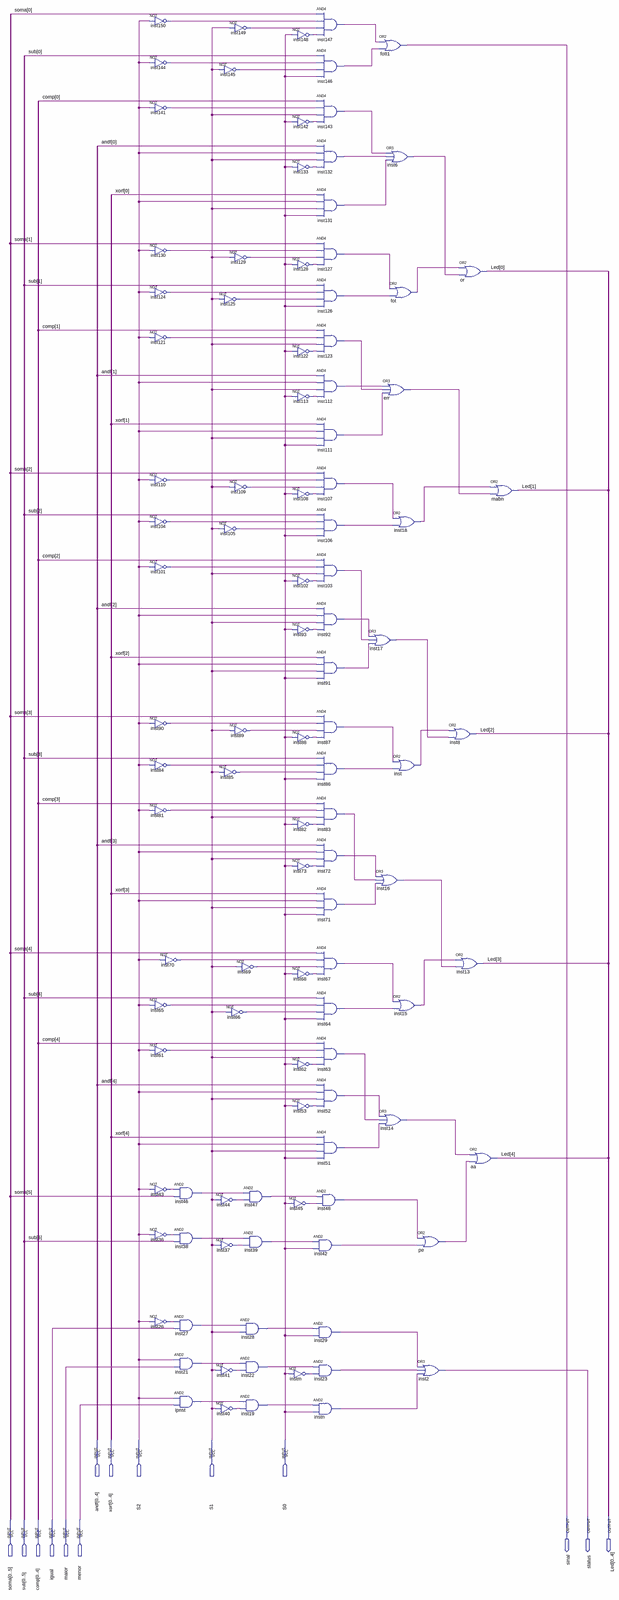
[diagram p0: schematic sheet, whole]
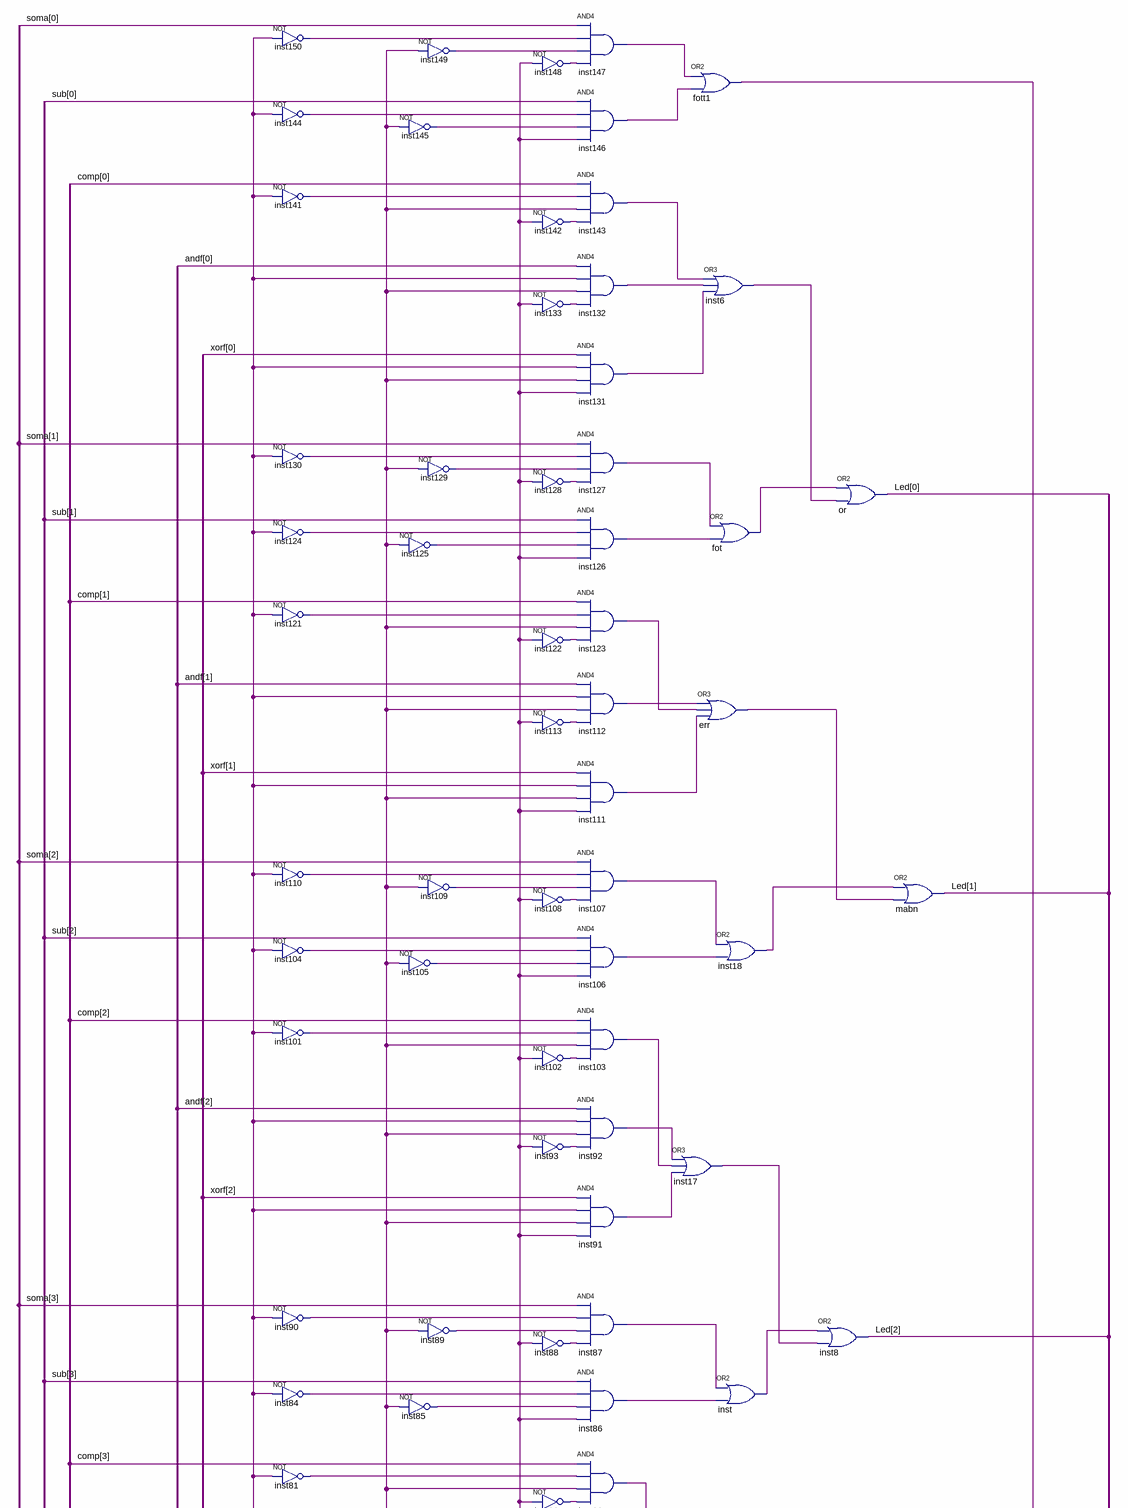
[diagram p1: schematic sheet, upper part]
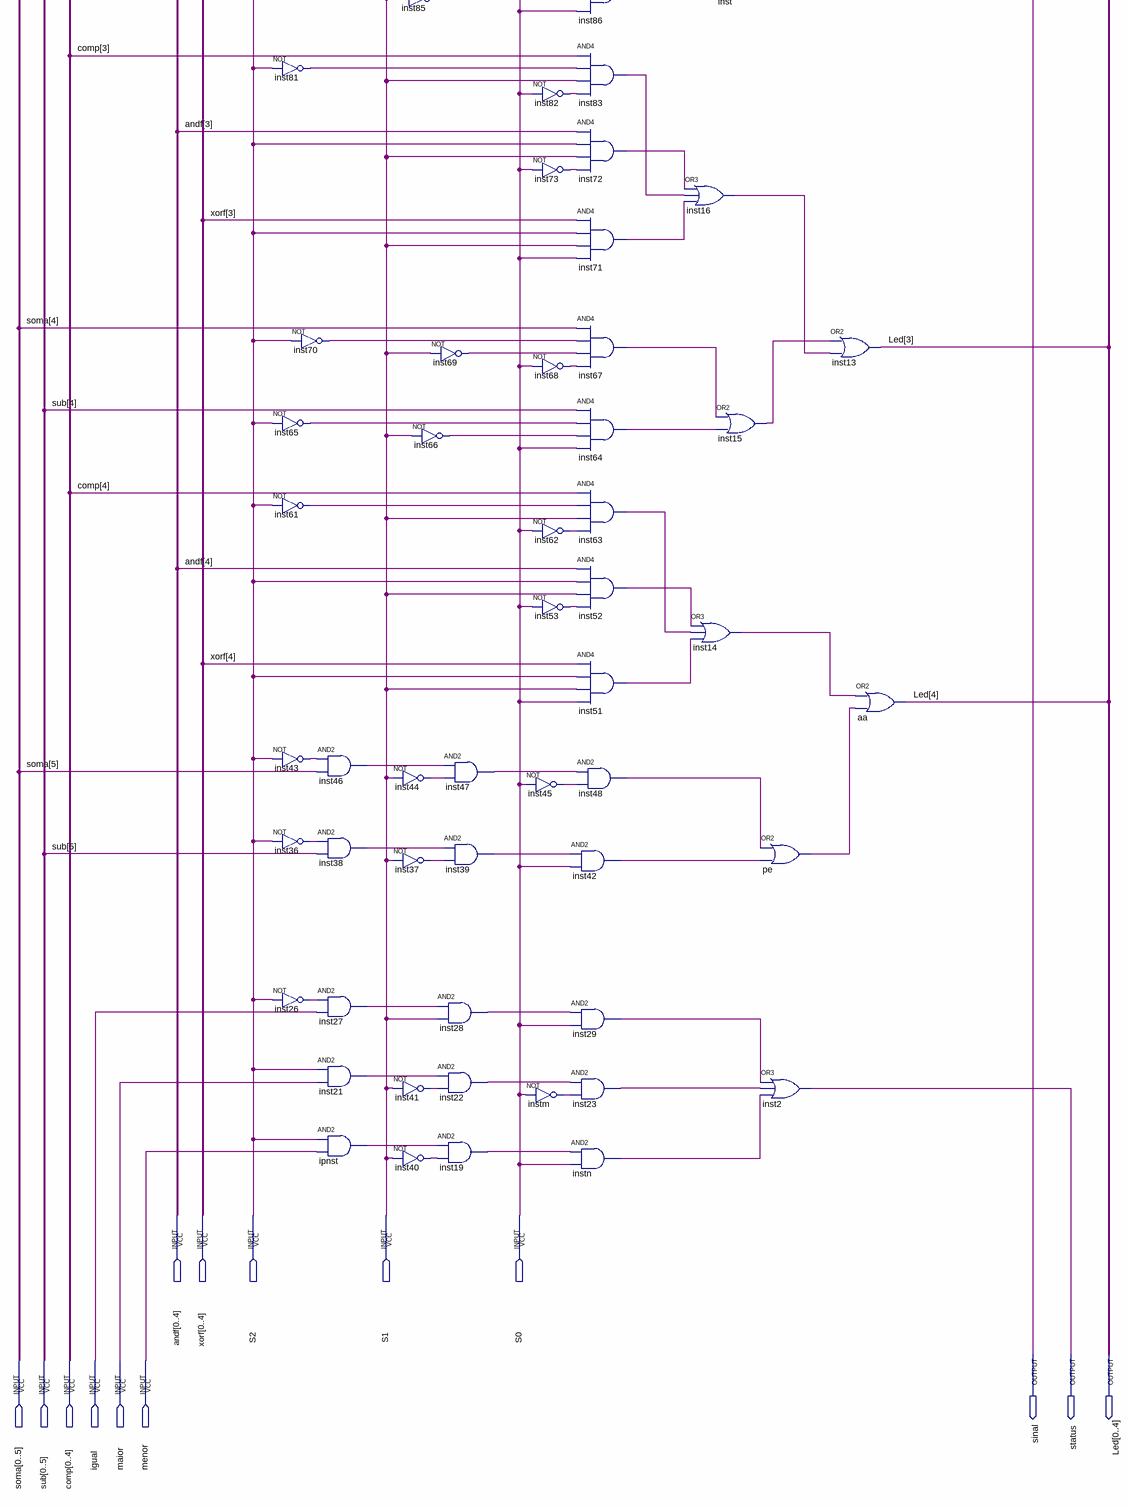
[diagram p2: schematic sheet, lower part]
// Quartus schematic mux8.bdf as structural Verilog: 106 symbols, 14 pins
module mux8 (
  input  [0:4] andf,
  input  [0:4] xorf,
  input  S2,
  input  S1,
  input  S0,
  input  [0:5] soma,
  input  [0:5] sub,
  input  [0:4] comp,
  input  igual,
  input  maior,
  input  menor,
  output sinal,
  output status,
  output [0:4] Led
);

  wire err_out, fot_out, inst6_out, inst14_out, inst15_out, inst16_out, inst17_out, inst18_out, inst19_out,
       inst21_out, inst22_out, inst23_out, inst26_out, inst27_out, inst28_out, inst29_out, inst36_out,
       inst37_out, inst38_out, inst39_out, inst40_out, inst41_out, inst42_out, inst43_out, inst44_out,
       inst45_out, inst46_out, inst47_out, inst48_out, inst51_out, inst52_out, inst53_out, inst61_out,
       inst62_out, inst63_out, inst64_out, inst65_out, inst66_out, inst67_out, inst68_out, inst69_out,
       inst70_out, inst71_out, inst72_out, inst73_out, inst81_out, inst82_out, inst83_out, inst84_out,
       inst85_out, inst86_out, inst87_out, inst88_out, inst89_out, inst90_out, inst91_out, inst92_out,
       inst93_out, inst101_out, inst102_out, inst103_out, inst104_out, inst105_out, inst106_out, inst107_out,
       inst108_out, inst109_out, inst110_out, inst111_out, inst112_out, inst113_out, inst121_out,
       inst122_out, inst123_out, inst124_out, inst125_out, inst126_out, inst127_out, inst128_out,
       inst129_out, inst130_out, inst131_out, inst132_out, inst133_out, inst141_out, inst142_out,
       inst143_out, inst144_out, inst145_out, inst146_out, inst147_out, inst148_out, inst149_out,
       inst150_out, inst_out, instm_out, instn_out, ipnst_out, pe_out;

  not inst150 (inst150_out, S2);
  not inst144 (inst144_out, S2);
  not inst141 (inst141_out, S2);
  not inst130 (inst130_out, S2);
  not inst124 (inst124_out, S2);
  not inst121 (inst121_out, S2);
  not inst110 (inst110_out, S2);
  not inst104 (inst104_out, S2);
  not inst101 (inst101_out, S2);
  not inst90 (inst90_out, S2);
  not inst84 (inst84_out, S2);
  not inst81 (inst81_out, S2);
  not inst65 (inst65_out, S2);
  not inst61 (inst61_out, S2);
  not inst43 (inst43_out, S2);
  not inst36 (inst36_out, S2);
  not inst26 (inst26_out, S2);
  not inst70 (inst70_out, S2);
  and inst46 (inst46_out, inst43_out, soma[5]);
  and inst38 (inst38_out, inst36_out, sub[5]);
  and inst27 (inst27_out, inst26_out, igual);
  and inst21 (inst21_out, S2, maior);
  and ipnst (ipnst_out, S2, menor);
  not inst149 (inst149_out, S1);
  not inst145 (inst145_out, S1);
  not inst129 (inst129_out, S1);
  not inst125 (inst125_out, S1);
  not inst109 (inst109_out, S1);
  not inst105 (inst105_out, S1);
  not inst89 (inst89_out, S1);
  not inst85 (inst85_out, S1);
  not inst69 (inst69_out, S1);
  not inst66 (inst66_out, S1);
  not inst44 (inst44_out, S1);
  not inst37 (inst37_out, S1);
  and inst28 (inst28_out, inst27_out, S1);
  and inst22 (inst22_out, inst21_out, inst41_out);
  not inst41 (inst41_out, S1);
  and inst19 (inst19_out, ipnst_out, inst40_out);
  not inst40 (inst40_out, S1);
  and inst47 (inst47_out, inst46_out, inst44_out);
  and inst39 (inst39_out, inst38_out, inst37_out);
  not inst148 (inst148_out, S0);
  not inst142 (inst142_out, S0);
  not inst133 (inst133_out, S0);
  not inst128 (inst128_out, S0);
  not inst122 (inst122_out, S0);
  not inst113 (inst113_out, S0);
  not inst108 (inst108_out, S0);
  not inst102 (inst102_out, S0);
  not inst93 (inst93_out, S0);
  not inst88 (inst88_out, S0);
  not inst82 (inst82_out, S0);
  not inst73 (inst73_out, S0);
  not inst68 (inst68_out, S0);
  not inst62 (inst62_out, S0);
  not inst53 (inst53_out, S0);
  not inst45 (inst45_out, S0);
  not instm (instm_out, S0);
  and inst147 (inst147_out, soma[0], inst150_out, inst149_out, inst148_out);
  and inst146 (inst146_out, sub[0], inst144_out, inst145_out, S0);
  and inst143 (inst143_out, comp[0], inst141_out, S1, inst142_out);
  and inst132 (inst132_out, andf[0], S2, S1, inst133_out);
  and inst131 (inst131_out, xorf[0], S2, S1, S0);
  and inst127 (inst127_out, soma[1], inst130_out, inst129_out, inst128_out);
  and inst126 (inst126_out, sub[1], inst124_out, inst125_out, S0);
  and inst123 (inst123_out, comp[1], inst121_out, S1, inst122_out);
  and inst112 (inst112_out, andf[1], S2, S1, inst113_out);
  and inst111 (inst111_out, xorf[1], S2, S1, S0);
  and inst107 (inst107_out, soma[2], inst110_out, inst109_out, inst108_out);
  and inst106 (inst106_out, sub[2], inst104_out, inst105_out, S0);
  and inst103 (inst103_out, comp[2], inst101_out, S1, inst102_out);
  and inst92 (inst92_out, andf[2], S2, S1, inst93_out);
  and inst91 (inst91_out, xorf[2], S2, S1, S0);
  and inst87 (inst87_out, soma[3], inst90_out, inst89_out, inst88_out);
  and inst86 (inst86_out, sub[3], inst84_out, inst85_out, S0);
  and inst83 (inst83_out, comp[3], inst81_out, S1, inst82_out);
  and inst72 (inst72_out, andf[3], S2, S1, inst73_out);
  and inst71 (inst71_out, xorf[3], S2, S1, S0);
  and inst67 (inst67_out, soma[4], inst70_out, inst69_out, inst68_out);
  and inst64 (inst64_out, sub[4], inst65_out, inst66_out, S0);
  and inst63 (inst63_out, comp[4], inst61_out, S1, inst62_out);
  and inst52 (inst52_out, andf[4], S2, S1, inst53_out);
  and inst51 (inst51_out, xorf[4], S2, S1, S0);
  and inst48 (inst48_out, inst47_out, inst45_out);
  and inst42 (inst42_out, inst39_out, S0);
  and inst29 (inst29_out, inst28_out, S0);
  and inst23 (inst23_out, inst22_out, instm_out);
  and instn (instn_out, inst19_out, S0);
  or fott1 (sinal, inst147_out, inst146_out);
  or inst17 (inst17_out, inst92_out, inst103_out, inst91_out);
  or inst16 (inst16_out, inst72_out, inst83_out, inst71_out);
  or inst14 (inst14_out, inst52_out, inst63_out, inst51_out);
  or inst6 (inst6_out, inst143_out, inst132_out, inst131_out);
  or fot (fot_out, inst127_out, inst126_out);
  or err (err_out, inst112_out, inst123_out, inst111_out);
  or inst18 (inst18_out, inst107_out, inst106_out);
  or inst (inst_out, inst87_out, inst86_out);
  or inst15 (inst15_out, inst67_out, inst64_out);
  or pe (pe_out, inst48_out, inst42_out);
  or inst2 (status, inst29_out, inst23_out, instn_out);
  or \or  (Led[0], fot_out, inst6_out);
  or inst8 (Led[2], inst_out, inst17_out);
  or inst13 (Led[3], inst15_out, inst16_out);
  or mabn (Led[1], inst18_out, err_out);
  or aa (Led[4], inst14_out, pe_out);
endmodule
